# Altium schematic sheet ZLS_Signal_Conditioner.SchDoc
size Tabloid
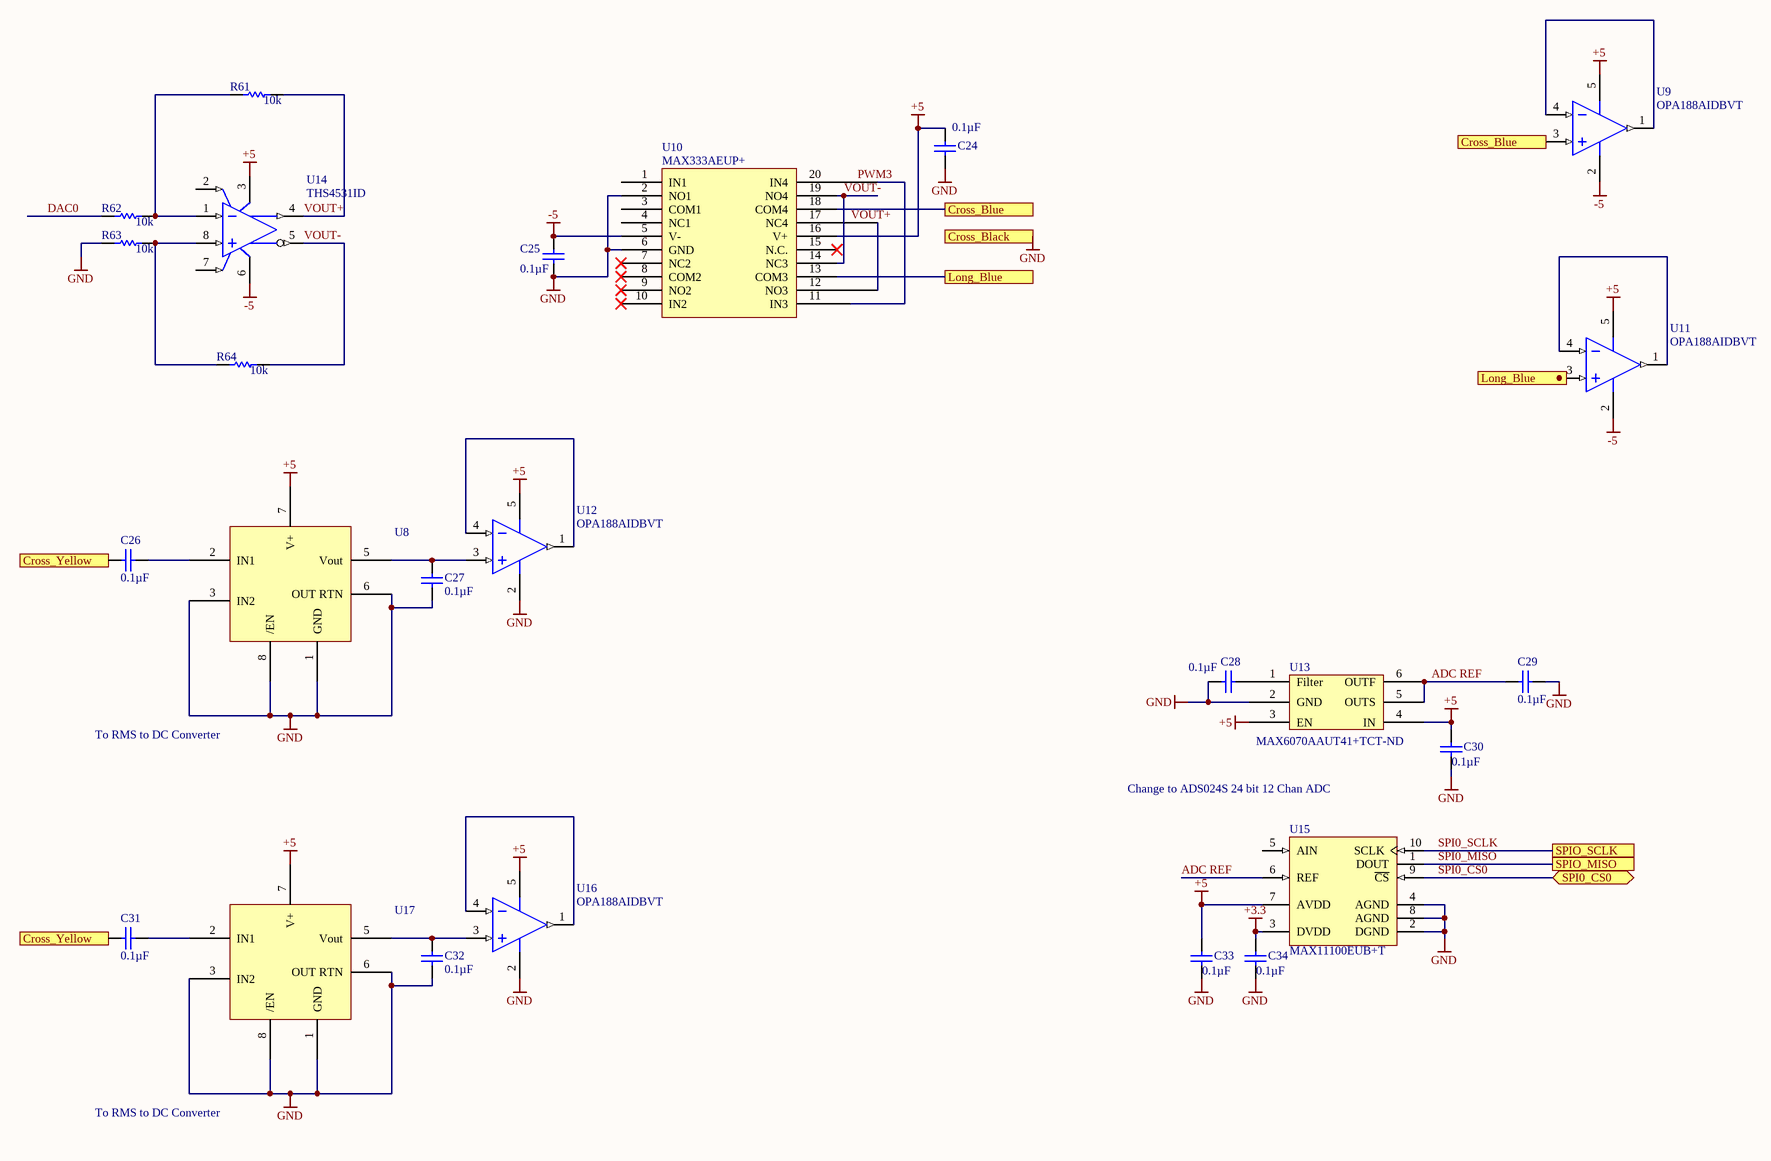
[diagram p0: ZLS_Signal_Conditioner.SchDoc]

## Parts
C24  Capacitance: 0.1µF  [CAPC0805(2012)145_N]  (hidden comment: CAP CER 0.1UF 25V X7R 0805)
C25  Capacitance: 0.1µF  [CAPC0805(2012)145_N]  (hidden comment: CAP CER 0.1UF 25V X7R 0805)
C26  Capacitance: 0.1µF  [CAPC0805(2012)145_N]  (hidden comment: CAP CER 0.1UF 25V X7R 0805)
C27  Capacitance: 0.1µF  [CAPC0805(2012)145_N]  (hidden comment: CAP CER 0.1UF 25V X7R 0805)
C28  Capacitance: 0.1µF  [CAPC0805(2012)145_N]  (hidden comment: CAP CER 0.1UF 25V X7R 0805)
C29  Capacitance: 0.1µF  [CAPC0805(2012)145_N]  (hidden comment: CAP CER 0.1UF 25V X7R 0805)
C30  Capacitance: 0.1µF  [CAPC0805(2012)145_N]  (hidden comment: CAP CER 0.1UF 25V X7R 0805)
C31  Capacitance: 0.1µF  [CAPC0805(2012)145_N]  (hidden comment: CAP CER 0.1UF 25V X7R 0805)
C32  Capacitance: 0.1µF  [CAPC0805(2012)145_N]  (hidden comment: CAP CER 0.1UF 25V X7R 0805)
C33  Capacitance: 0.1µF  [CAPC0805(2012)145_N]  (hidden comment: CAP CER 0.1UF 25V X7R 0805)
C34  Capacitance: 0.1µF  [CAPC0805(2012)145_N]  (hidden comment: CAP CER 0.1UF 25V X7R 0805)
R61  10k  [RESC0805(2012)_L]
R62  10k  [RESC0805(2012)_L]
R63  10k  [RESC0805(2012)_L]
R64  10k  [RESC0805(2012)_L]
U8  LTC1967  [LTC1967]  (value not drawn)
U9  OPA188AIDBVT  [DBV0005A_L]
U10  MAX333AEUP+  [TSOP65P640X90-20N]
U11  OPA188AIDBVT  [DBV0005A_L]
U12  OPA188AIDBVT  [DBV0005A_L]
U13  Supplier Part Number 1: MAX6070AAUT41+TCT-ND  [SOT95P280X445-6N]  (hidden comment: MAX6070AAUT41+T)
U14  THS4531ID  [D0008A_N]
U15  MAX11100EUB+T  [U10+2_L]
U16  OPA188AIDBVT  [DBV0005A_L]
U17  LTC1967  [LTC1967]  (value not drawn)

## Ports
Cross_Black, Cross_Blue, Cross_Yellow, Long_Blue, SPI0_CS0, SPIO_MISO, SPIO_SCLK

## Nets
+3.3: C34.1 U15.3(DVDD)
+5: C24.1 C30.1 C33.1 U8.7(V+) U9.5(V+) U10.16(V+) U11.5(V+) U12.5(V+) U13.3(EN) U13.4(IN) U14.3(VS+) U15.7(AVDD) U16.5(V+) U17.7(V+)
-5: C25.1 U9.2(V-) U10.5(V-) U11.2(V-) U14.6(VS-)
GND: C24.2 C25.2 C27.1 C28.1 C29.2 C30.2 C32.1 C33.2 C34.2 R63.1 U8.1(GND) U8.3(IN2) U8.6(OUT_RTN) U8.8(/EN) U10.2(NO1) U10.6(GND) U12.2(V-) U13.2(GND) U15.2(DGND) U15.4(AGND) U15.8(AGND) U16.2(V-) U17.1(GND) U17.3(IN2) U17.6(OUT_RTN) U17.8(/EN) ; port Cross_Black
ADC REF: C29.1 U13.5(OUTS) U13.6(OUTF) U15.6(REF)
Cross_Blue: U9.3(IN+) U10.18(COM4) ; port Cross_Blue
Cross_Yellow: C26.1 C31.1 ; port Cross_Yellow
DAC0: R62.1
Long_Blue: U10.13(COM3) ; port Long_Blue
PWM3: U10.11(IN3) U10.20(IN4)
SPI0_CS0: U15.9(~{CS}) ; port SPI0_CS0
SPI0_MISO: U15.1(DOUT) ; port SPIO_MISO
SPI0_SCLK: U15.10(SCLK) ; port SPIO_SCLK
VOUT+: R61.2 U10.12(NO3) U10.17(NC4) U14.4(VOUT+)
VOUT-: R64.2 U10.14(NC3) U10.19(NO4) U14.5(VOUT-)
NetC26_2: C26.2 U8.2(IN1)
NetC27_2: C27.2 U8.5(Vout) U12.3(IN+)
NetC28_2: C28.2 U13.1(Filter)
NetC31_2: C31.2 U17.2(IN1)
NetC32_2: C32.2 U16.3(IN+) U17.5(Vout)
NetR61_1: R61.1 R62.2 U14.1(VIN-)
NetR63_2: R63.2 R64.1 U14.8(VIN+)
NetU9_1: U9.1(OUT) U9.4(IN-)
NetU11_1: U11.1(OUT) U11.4(IN-)
NetU12_1: U12.1(OUT) U12.4(IN-)
NetU16_1: U16.1(OUT) U16.4(IN-)

Not connected (* = marked no-connect by the designer): U8 4(NC); U10 1(IN1) 3(COM1) 4(NC1) 7(NC2)* 8(COM2)* 9(NO2)* 10(IN2)* 15(N.C.)*; U11 3(IN+); U14 2(VOCM) 7(~{PD}); U15 5(AIN); U17 4(NC)

## Notes on the sheet
- To RMS to DC Converter
- Change to ADS024S 24 bit 12 Chan ADC
- Title
- Size:
- Date:
- Tabloid
- Number:
- Time:
- Revision:
- Sheet
- of
- ZLS Corporation
- 7801 North Lamar Blvd.
- Suite E-184
- Austin, Texas 78752  USA
- (512) 453-0288
- File:

## Library data of the parts
C24-C34 = CMP-1036-04795-1: Manufacturer: Murata Electronics North America; Manufacturer Part Number: GRM21BR71E104KA01L; Tolerance: ±10%; Supplier 1: Digi-Key; Supplier Part Number 1: 490-1673-6-ND; RoHS: RoHS Compliant; Category: Capacitors; Stock 1: 891652; Pricing 1: 1=0.2, 10=0.145, 100=0.0683, 500=0.04788, 1000=0.03964 (USD); Packaging: Digi-Reel®; Part Status: Active; Voltage - Rated: 25V; Temperature Coefficient: X7R; Operating Temperature: -55°C ~ 125°C; Features: -; Ratings: -; Applications: General Purpose; Mounting Type: Surface Mount, MLCC; Package / Case: 0805 (2012 Metric); Size / Dimension: 0.079" L x 0.049" W (2.00mm x 1.25mm); Height - Seated (Max): -; Thickness (Max): 0.053" (1.35mm); Lead Spacing: -; Lead Style: -; ComponentLink1URL: http://www.murata.com/~/media/webrenewal/support/library/catalog/products/capacitor/mlcc/c02e.ashx; ComponentLink1Description: http://www.murata.com/~/media/webrenewal/support/library/catalog/products/capacitor/mlcc/c02e.ashx
R61-R64 = CMP-1013-00393-1: RES SMD 10K OHM 1% 1/8W 0805; Manufacturer: Vishay Dale; Manufacturer Part Number: CRCW080510K0FKEA; Power (Watts): 0.125W, 1/8W; Temperature Coefficient: ±100ppm/°C; Supplier 1: Digi-Key; Supplier Part Number 1: 541-10.0KCCT-ND; RoHS: RoHS Compliant; Category: Resistors; Stock 1: 1858038; Pricing 1: 1=0.1, 10=0.055, 100=0.0223, 1000=0.01003, 2500=0.0087 (USD); Packaging: Cut Tape (CT); Part Status: Active; Tolerance: ±1%; Composition: Thick Film; Features: Automotive AEC-Q200; Operating Temperature: -55°C ~ 155°C; Package / Case: 0805 (2012 Metric); Supplier Device Package: 0805; Size / Dimension: 0.079" L x 0.049" W (2.00mm x 1.25mm); Height - Seated (Max): 0.020" (0.50mm); Failure Rate: -; ComponentLink1URL: http://www.vishay.com/docs/20035/dcrcwe3.pdf; ComponentLink1Description: http://www.vishay.com/docs/20035/dcrcwe3.pdf
U8 U17 = LTC1967: IC CONVERTER RMS-DC PREC 9MSOP
U9 U11 U12 U16 = CMP-0809-00006-2: Precision, Low Noise, Rail-to-Rail Output, Zero-Drift Operational Amplifier, 4 to 36 V, -40 to 125 degC, 5-pin SOT23 (DBV5), Green (RoHS & no Sb/Br); Manufacturer: Texas Instruments; Iq per channel(Max)(mA): 0.51; Total Supply Voltage(Max)(+5V is 5, +/-5V is 10): 36; GBW(Typ)(MHz): 2; SubFamily: Zero Drift Precision Amplifier; Rating: Catalog; CMRR(Min)(dB): 120; Number of Channels: 1; Slew Rate(Typ)(V/us): 0.8; Total Supply Voltage(Min)(+5V is 5, +/-5V is 10): 4; Offset Drift(Typ)(uV/C): 0.03; PackageDescription: 5-Pin Plastic Small Outline, Body 1.6 x 2.9 mm, Pitch 0.95 mm; PackageReference: DBV0005A; ComponentLink3Description: Package Specification; ComponentLink3URL: http://www.ti.com/litv/pdf/mpds018i; Mounting Technology: Surface Mount; ComponentLink2URL: http://www.ti.com/lit/ds/symlink/opa188.pdf; Code_JEDEC: MO-178; PackageVersion: 4073253-4/K, 03/2006; ComponentLink2Description: Datasheet; DatasheetVersion: SBOS642A; ComponentLink1URL: http://www.ti.com/; ComponentLink1Description: Manufacturer URL; Eco-Plan: Green (RoHS & no Sb/Br); PartNumber: OPA188AIDBVT
U10 = MAX333CWP+: IC SWITCH QUAD SPDT 20TSSOP; Manufacturer: Maxim Integrated; Multiplexer/Demultiplexer Circuit: 2:1; On-State Resistance (Max): 45 Ohm; Channel-to-Channel Matching (&Delta;Ron): 2 Ohm (Max); Voltage - Supply, Single (V+): 10 V ~ 30 V; Voltage - Supply, Dual (V±): ±4.5 V ~ 20 V; Switch Time (Ton, Toff) (Max): 175ns, 145ns; Charge Injection: 2pC; Channel Capacitance (CS(off), CD(off)): 5pF; Current - Leakage (IS(off)) (Max): 250pA; Crosstalk: -78dB @ 1MHz; Supplier 1: Digi-Key; Supplier Part Number 1: MAX333AEUP+-ND; Manufacturer Part Number: MAX333AEUP+; RoHS: RoHS Compliant; Category: Integrated Circuits (ICs); Stock 1: 1328; Pricing 1: 1=6.77, 10=6.432, 25=6, 50=5.8942 (USD); Packaging: Tube; Part Status: Active; Switch Circuit: SPDT; -3db Bandwidth: -; Operating Temperature: -40°C ~ 85°C (TA); Package / Case: 20-TSSOP (0.173", 4.40mm Width); Supplier Device Package: 20-TSSOP; Base Part Number: MAX333; ComponentLink1URL: https://pdfserv.maximintegrated.com/en/ds/MAX333A.pdf; ComponentLink1Description: https://pdfserv.maximintegrated.com/en/ds/MAX333A.pdf
U13 = MAX6070AAUT41+T: IC VREF SERIES 4.096V SOT23; Manufacturer: Maxim Integrated; Output Type: Fixed; Tolerance: ±0.04%; Temperature Coefficient: 6ppm/°C; Noise - 0.1Hz to 10Hz: 9.6µVp-p; Noise - 10Hz to 10kHz: 9µVrms; Voltage - Input: 4.3 V ~ 5.5 V; Current - Supply: 350µA; Supplier 1: Digi-Key; Manufacturer Part Number: MAX6070AAUT41+T; RoHS: RoHS Compliant; Category: Integrated Circuits (ICs); Stock 1: 2623; Pricing 1: 1=3.41, 10=3.213, 25=2.5704, 50=2.4418, 100=2.2491, 250=2.13344, 500=2.05634 (USD); Packaging: Cut Tape (CT); Part Status: Active; Reference Type: Series; Voltage - Output (Min/Fixed): 4.096V; Operating Temperature: -40°C ~ 125°C (TA); Mounting Type: Surface Mount; Package / Case: SOT-23-6; Supplier Device Package: SOT-23-6; ComponentLink1URL: https://datasheets.maximintegrated.com/en/ds/MAX6070-MAX6071.pdf; ComponentLink1Description: https://datasheets.maximintegrated.com/en/ds/MAX6070-MAX6071.pdf
U14 = CMP-0811-00005-2: Ultra Low Power 0.25 mA, RRO, Fully Differential Amplifier, 2.5 to 5.5V, -40 to 125 degC, 8-pin SOIC (D8), Green (RoHS & no Sb/Br); Manufacturer: Texas Instruments; Slew Rate(Typ)(V/us): 15; BW @ Acl(MHz): 24; THD (Fc is 1 MHz)(Typ)(dB): -107; Settling Time (0.1%)(Typ)(ns): 60; 3rd Harmonic(dBc): -137; Io(Typ)(mA): 26; Vio(Max)(mV): 1; 2nd Harmonic(dBc): -128; Iq per channel(Max)(mA): 0.35; Offset Voltage Drift (+/-)(Max)(uV/Degrees Celsius: 10; Vs(Min)(V): 2.5; Vs(Max)(V): 5.5; PackageReference: D0008A; SubFamily: Fully Differential Amplifier; PackageVersion: 4040047-3/M, 06/2011; ComponentLink3Description: Package Specification; PartNumber: THS4531ID; DatasheetVersion: SLOS358B; ComponentLink2URL: http://www.ti.com/general/docs/lit/getliterature.tsp?genericPartNumber=THS4531&fileType=pdf; Number of Channels: 1; Code_JEDEC: MS-012; ComponentLink1URL: http://www.ti.com/; PackageDescription: 8-Pin Plastic Small Outline, Body 4.9 x 3.9 mm, Pitch 1.27 mm; Vn at Flatband(Typ)(nV/rtHz): 10; Eco-Plan: Green (RoHS & no Sb/Br); Mounting Technology: Surface Mount; ComponentLink1Description: Manufacturer URL; ComponentLink3URL: http://www.ti.com/litv/pdf/msoi002j; ComponentLink2Description: Datasheet
U15 = CMP-0249-00017-1: 16-Bit, +5V, 200ksps ADC with 10uA Shutdown, 10-Pin uMAX, -40°C to +85°C, Pb-Free, Tape and Reel; DatasheetVersion: Rev 1, Jan-2012; ComponentLink3URL: http://pdfserv.maxim-ic.com/package_dwgs/21-0061.PDF; PackageReference: U10+2; ComponentLink2URL: http://datasheets.maxim-ic.com/en/ds/MAX11100.pdf; PackageVersion: revL, 2008; ComponentLink1Description: Manufacturer URL; Code_JEDEC: MO-187-BA; ComponentLink1URL: http://www.maxim-ic.com; ComponentLink3Description: Package Specification; PackageDescription: 10-Pin Micro-MAX Thin Shrink Small Outline (uSOP), 3 x 3 x 0.85 mm Body, 0.5 mm Pitch, Pb-Free; ComponentLink2Description: Datasheet